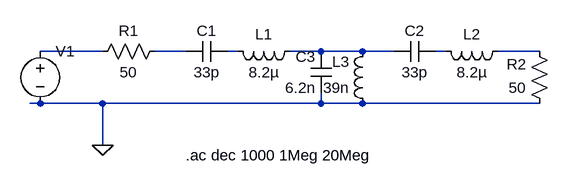
[diagram p0: schematic spice-model.asc]
spice-model.asc, the LTspice schematic file:
Version 4
SHEET 1 880 680
WIRE 128 240 32 240
WIRE 256 240 208 240
WIRE 336 240 320 240
WIRE 464 240 416 240
WIRE 528 240 464 240
WIRE 576 240 528 240
WIRE 656 240 640 240
WIRE 800 240 736 240
WIRE 32 320 16 320
WIRE 128 320 32 320
WIRE 464 320 464 304
WIRE 464 320 128 320
WIRE 528 320 464 320
WIRE 800 320 528 320
WIRE 128 384 128 320
FLAG 128 384 0
SYMBOL cap 320 224 R90
WINDOW 0 0 32 VBottom 2
WINDOW 3 32 32 VTop 2
SYMATTR InstName C1
SYMATTR Value 33p
SYMBOL cap 640 224 R90
WINDOW 0 0 32 VBottom 2
WINDOW 3 32 32 VTop 2
SYMATTR InstName C2
SYMATTR Value 33p
SYMBOL cap 480 304 R180
WINDOW 0 24 56 Left 2
WINDOW 3 24 8 Left 2
SYMATTR InstName C3
SYMATTR Value 6.2n
SYMBOL ind 432 224 R90
WINDOW 0 5 56 VBottom 2
WINDOW 3 32 56 VTop 2
SYMATTR InstName L1
SYMATTR Value 8.2µ
SYMATTR SpiceLine Rser=4.48
SYMBOL ind 752 224 R90
WINDOW 0 5 56 VBottom 2
WINDOW 3 32 56 VTop 2
SYMATTR InstName L2
SYMATTR Value 8.2µ
SYMATTR SpiceLine Rser=4.48
SYMBOL ind 544 336 R180
WINDOW 0 36 80 Left 2
WINDOW 3 36 40 Left 2
SYMATTR InstName L3
SYMATTR Value 39n
SYMATTR SpiceLine Rser=0.041
SYMBOL res 224 224 R90
WINDOW 0 0 56 VBottom 2
WINDOW 3 32 56 VTop 2
SYMATTR InstName R1
SYMATTR Value 50
SYMBOL res 816 336 R180
WINDOW 0 36 76 Left 2
WINDOW 3 36 40 Left 2
SYMATTR InstName R2
SYMATTR Value 50
SYMBOL voltage 32 224 R0
SYMATTR InstName V1
SYMATTR Value ""
SYMATTR Value2 AC 1 0
TEXT 256 400 Left 2 !.ac dec 1000 1Meg 20Meg

The netlist it stands for:
* spice-model.asc
C1 N003 N002 33p
C2 N005 N004 33p
C3 0 N004 6.2n
L1 N004 N003 8.2µ Rser=4.48
L2 N006 N005 8.2µ Rser=4.48
L3 0 N004 39n Rser=0.041
R1 N002 N001 50
R2 0 N006 50
V1 N001 0 AC 1 0
.ac dec 1000 1Meg 20Meg
.backanno
.end